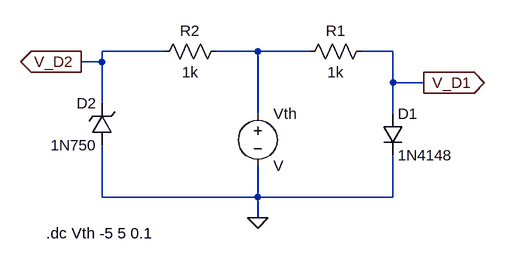
[diagram p0: schematic Diode_characteristics.asc]
Diode_characteristics.asc, the LTspice schematic file:
Version 4
SHEET 1 880 680
WIRE -16 32 -112 32
WIRE 128 32 64 32
WIRE 208 32 128 32
WIRE 336 32 288 32
WIRE -112 48 -112 32
WIRE -112 48 -144 48
WIRE 336 80 336 32
WIRE 384 80 336 80
WIRE -112 112 -112 48
WIRE 128 128 128 32
WIRE 336 128 336 80
WIRE -112 256 -112 176
WIRE 128 256 128 208
WIRE 128 256 -112 256
WIRE 336 256 336 192
WIRE 336 256 128 256
WIRE 128 288 128 256
FLAG 384 80 V_D1
IOPIN 384 80 Out
FLAG -144 48 V_D2
IOPIN -144 48 Out
FLAG 128 288 0
SYMBOL voltage 128 112 R0
SYMATTR InstName Vth
SYMBOL diode 320 128 R0
SYMATTR InstName D1
SYMATTR Value 1N4148
SYMBOL res 304 16 R90
WINDOW 0 0 56 VBottom 2
WINDOW 3 32 56 VTop 2
SYMATTR InstName R1
SYMATTR Value 1k
SYMBOL zener -96 176 R180
WINDOW 0 24 64 Left 2
WINDOW 3 24 0 Left 2
SYMATTR InstName D2
SYMATTR Value 1N750
SYMBOL res 80 16 R90
WINDOW 0 0 56 VBottom 2
WINDOW 3 32 56 VTop 2
SYMATTR InstName R2
SYMATTR Value 1k
TEXT -198 312 Left 2 !.dc Vth -5 5 0.1

The netlist it stands for:
* Diode_characteristics.asc
Vth N001 0 V
D1 V_D1 0 1N4148
R1 V_D1 N001 1k
D2 0 V_D2 1N750
R2 N001 V_D2 1k
.model D D
.lib standard.dio
.dc Vth -5 5 0.1
.backanno
.end